# EAGLE design AccessControl (EAGLE 7.3.0)
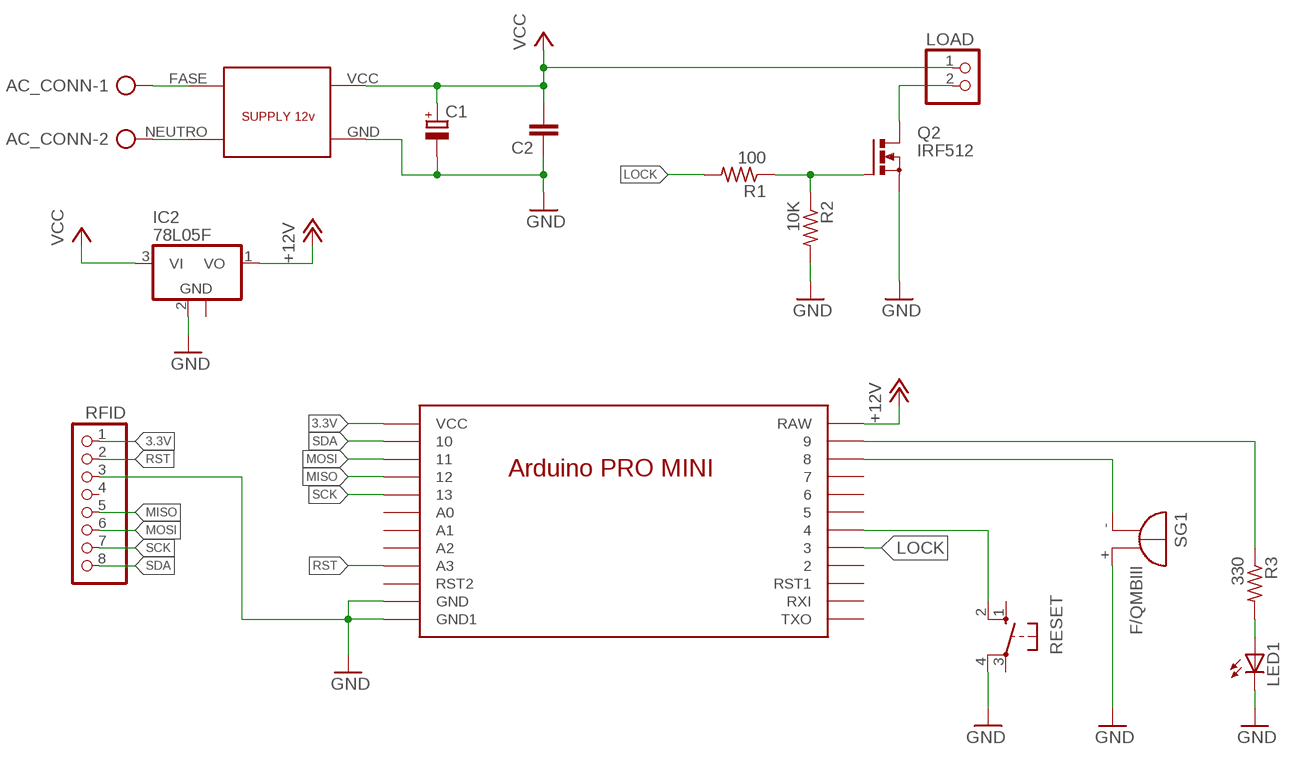
[diagram p0: schematic, sheet 1]

## Parts
AC_CONN  AK300/2  [AK300/2]
C1  CPOL-EUE2.5-6  [E2,5-6]
C2  C2.5/2  [C2.5-2]
IC2  78L05F  [SOT89]
LED1  LED3MM  [LED3MM]
LOAD  PINHD-1X2  [1X02]
Q2  IRF512  [TO220BV]
R1  100  R-US_0204/7  [0204/7]
R2  10K  R-US_0204/7  [0204/7]
R3  330  R-US_0204/7  [0204/7]
RESET  10-XX  [B3F-10XX]
RFID  PINHD-1X8  [1X08]
SG1  F/QMBIII  [F/QMBIII]
U$1  NANO  [NANO]
U$2  SUPPLY12V  [SUPPLY12V]

## Nets
3.3V: RFID.1 U$1.VCC
+12V: IC2.1(VO) U$1.RAW
GND: C1.- C2.1 IC2.2(GND) LED1.K(C) Q2.S R2.2 RESET.4(P1) RFID.3 SG1.+(-) U$1.GND1(GND) U$1.GND2(GND1) U$2.GND
LOCK: R1.2 U$1.3
MISO: RFID.5 U$1.12
MOSI: RFID.6 U$1.11
N$1: Q2.G R1.1 R2.1
N$2: AC_CONN.2 U$2.NEUTRO
N$3: LOAD.2 Q2.D
N$4: LED1.A R3.2
N$5: AC_CONN.1 U$2.FASE
N$6: SG1.-(+) U$1.8
N$7: RESET.2(S1) U$1.4
N$8: R3.1 U$1.9
RST: RFID.2 U$1.A3
SCK: RFID.7 U$1.13
SDA: RFID.8 U$1.10
VCC: C1.+ C2.2 IC2.3(VI) LOAD.1 U$2.VCC
Unconnected: IC2.2@1(GND) RESET.1(S) RESET.3(P) RFID.4 U$1.2 U$1.5 U$1.6 U$1.7 U$1.A0 U$1.A1 U$1.A2 U$1.RST1 U$1.RST2 U$1.RXI U$1.TXO

## Library data of the parts
AC_CONN = con-ptr500:AK300/2: CONNECTOR; OC_FARNELL: unknown; OC_NEWARK: unknown
C1 = resistor:CPOL-EU: POLARIZED CAPACITOR, European symbol
C2 = capacitor-wima:C: CAPACITOR naming: grid - package width
IC2 = linear:78L*: POSITOIV-VOLTAGE REGULATORS Output up to 100 mA Source: Datasheet <http://focus.ti.com/lit/ds/symlink/ua78l05.pdf>
LED1 = led:LED: LED OSRAM: - CHIPLED LG R971, LG N971, LY N971, LG Q971, LY Q971, LO R971, LY R971 LH N974, LH R974 LS Q976, LO Q976, LY Q976 LO Q996 - Hyper CHIPLED LW Q18S LB Q993, LB Q99A, LB R99A - SideLED LS A670, LO A670, LY A670, LG A670, LP A670 LB A673, LV A673, LT A673, LW A673 LH A674 LY A675 LS A676, LA A676, LO A676, LY A676, LW A676 LS A679, LY A679, LG A679 - Hyper Micro SIDELED® LS Y876, LA Y876, LO Y876, LY Y876 LT Y87S - SmartLED LW L88C, LW L88S LB L89C, LB L89S, LG L890 LS L89K, LO L89K, LY L89K LS L896, LA L896, LO L896, LY L896 - TOPLED LS T670, LO T670, LY T670, LG T670, LP T670 LSG T670, LSP T670, LSY T670, LOP T670, LYG T670 LG T671, LOG T671, LSG T671 LB T673, LV T673, LT T673, LW T673 LH T674 LS T676, LA T676, LO T676, LY T676, LB T676, LH T676, LSB T676, LW T676 LB T67C, LV T67C, LT T67C, LS T67K, LO T67K, LY T67K, LW E67C LS E67B, LA E67B, LO E67B, LY E67B, LB E67C, LV E67C, LT E67C LW T67C LS T679, LY T679, LG T679 LS T770, LO T770, LY T770, LG T770, LP T770 LB T773, LV T773, LT T773, LW T773 LH T774 LS E675, LA E675, LY E675, LS T675 LS T776, LA T776, LO T776, LY T776, LB T776 LHGB T686 LT T68C, LB T68C - Hyper Mini TOPLED® LB M676 - Mini TOPLED Santana® LG M470 LS M47K, LO M47K, LY M47K Source: http://www.osram.convergy.de LUXEON: - LUMILED® LXK2-PW12-R00, LXK2-PW12-S00, LXK2-PW14-U00, LXK2-PW14-V00 LXK2-PM12-R00, LXK2-PM12-S00, LXK2-PM14-U00 LXK2-PE12-Q00, LXK2-PE12-R00, LXK2-PE12-S00, LXK2-PE14-T00, LXK2-PE14-U00 LXK2-PB12-K00, LXK2-PB12-L00, LXK2-PB12-M00, LXK2-PB14-N00, LXK2-PB14-P00, LXK2-PB14-Q00 LXK2-PR12-L00, LXK2-PR12-M00, LXK2-PR14-Q00, LXK2-PR14-R00 LXK2-PD12-Q00, LXK2-PD12-R00, LXK2-PD12-S00 LXK2-PH12-R00, LXK2-PH12-S00 LXK2-PL12-P00, LXK2-PL12-Q00, LXK2-PL12-R00 Source: www.luxeon.com KINGBRIGHT: KA-3528ASYC Source: www.kingbright.com
LOAD = pinhead:PINHD-1X2: PIN HEADER
Q2 = transistor-power:IRF512: N-CHANNEL MOS FET
R1-R3 = resistor:R-US_: RESISTOR, American symbol
RESET = switch-omron:10-XX: OMRON SWITCH; MPN: B3F-1000; OC_FARNELL: 176432; OC_NEWARK: 36M3542
RFID = pinhead:PINHD-1X8: PIN HEADER
SG1 = buzzer:F/QMBIII: BUZZER Source: Buerklin; OC_FARNELL: unknown; OC_NEWARK: unknown
U$1 = E-Lab:NANO
U$2 = E-Lab:SUPPLY12V

## Board
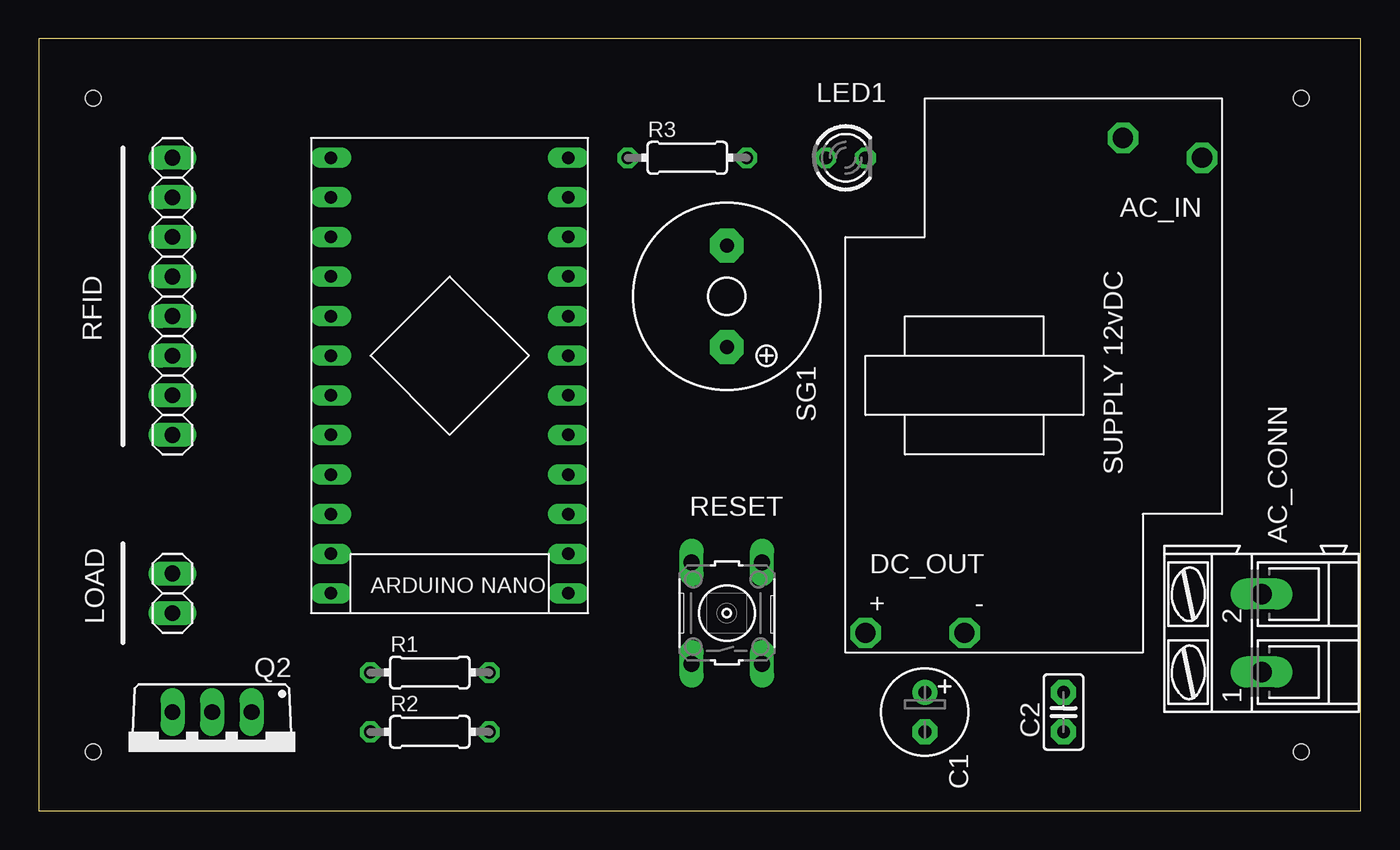
[diagram p1: board, top side]
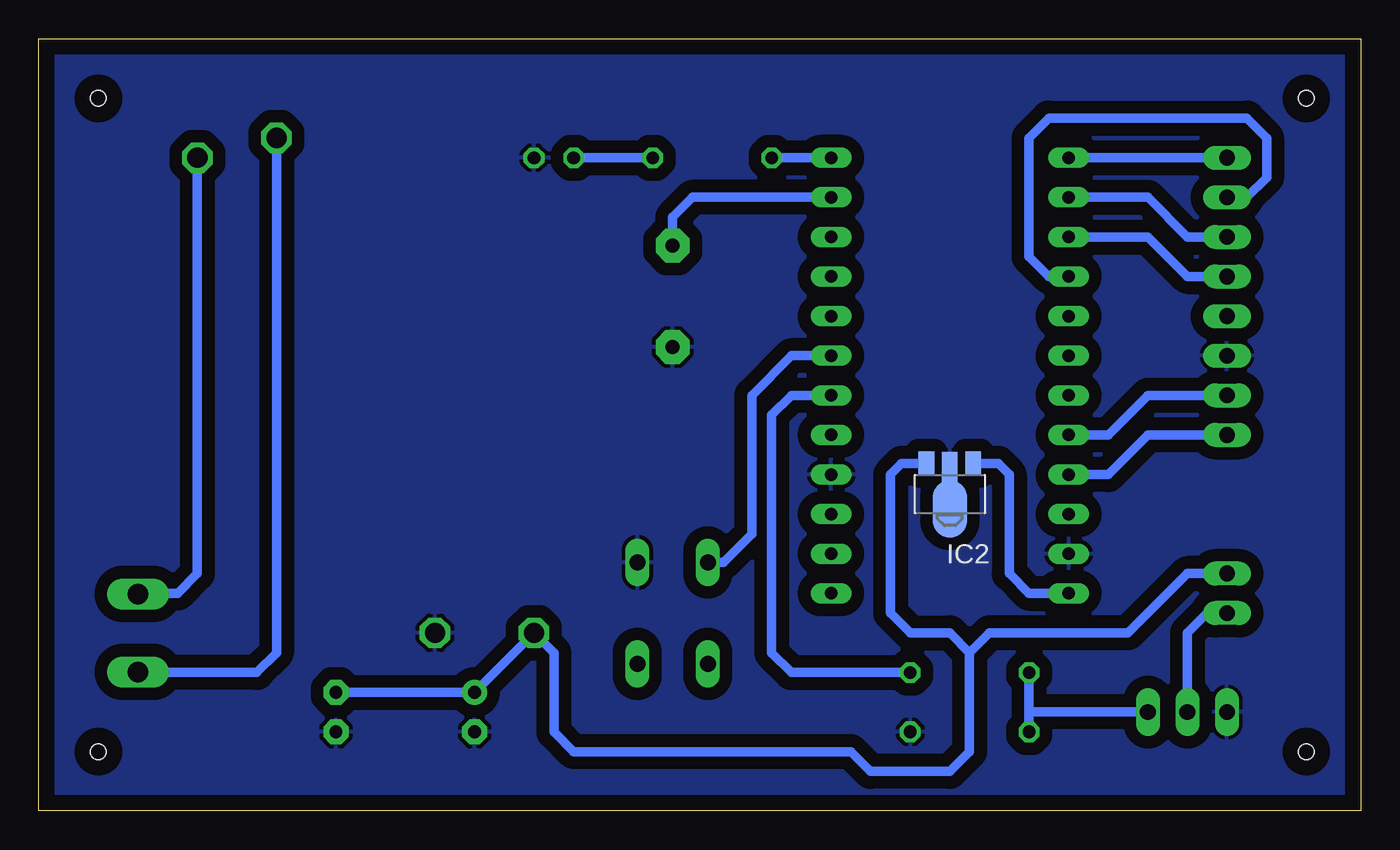
[diagram p2: board, bottom side, seen from below]

Size 84.76 x 49.52 mm. Coordinates in mm from the lower left corner, seen from the top.
Outline: 84.76,49.52 0,49.52 0,0 84.76,0 84.76,49.52
Copper layers (1*16): Top 0.035mm / dielectric 1.5mm / Bottom 0.035mm
Design rules "default": minimum track width 10mil, minimum drill 24mil, track to track 8mil, track to pad 8mil, pad to pad 8mil, via to via 8mil, smd to smd 8mil, copper to edge 40mil, drill to drill 8mil, minimum pad ring 10mil, minimum via ring 8mil, stop-mask expansion 4mil, vias tented up to drill 0mil, thermal gap 10mil
Holes 1 mm at 80.95,45.71 80.95,3.8 3.48,3.8 3.48,45.71

### Footprints (pad centres in the part's own frame; a part is rotated, then mirrored left to right if it is on the bottom)
AK300/2 = drill 1.321 long: 1 -2.515,0; 2 2.489,0
E2,5-6 = drill 0.813 pad 1.6: + -1.27,0 | drill 0.813 pad 1.6 octagon: - 1.27,0
C2.5-2 = drill 0.813 pad 1.6 octagon: 1 -1.27,0; 2 1.27,0
SOT89 = smd 1 x 1.5: 1 -1.499,-1.981; 3 1.499,-1.981 | smd 1 x 2: 2 0,-1.727 | smd 2.2 x 3.7: 2@1 0,0.94
LED3MM = drill 0.813 octagon: A -1.27,0; K 1.27,0
1X02 = drill 1.016 long: 1 -1.27,0; 2 1.27,0
TO220BV = drill 1.016 long: D 0,-2.54; G -2.54,-2.54; S 2.54,-2.54
0204/7 = drill 0.813 octagon: 1 -3.81,0; 2 3.81,0
B3F-10XX = drill 1.016 long: 1 -3.251,2.261; 2 3.251,2.261; 3 -3.251,-2.261; 4 3.251,-2.261
1X08 = drill 1.016 long: 1 -8.89,0; 2 -6.35,0; 3 -3.81,0; 4 -1.27,0; 5 1.27,0; 6 3.81,0; 7 6.35,0; 8 8.89,0
F/QMBIII = drill 0.914 pad 2.159 octagon: + 3.251,0; - -3.251,0
NANO = drill 0.8 long: 2 7.62,-5.08; 3 7.62,-2.54; 4 7.62,0; 5 7.62,2.54; 6 7.62,5.08; 7 7.62,7.62; 8 7.62,10.16; 9 7.62,12.7; 10 -7.62,12.7; 11 -7.62,10.16; 12 -7.62,7.62; 13 -7.62,5.08; A0 -7.62,2.54; A1 -7.62,0; A2 -7.62,-2.54; A3 -7.62,-5.08; GND1 -7.62,-12.7; GND2 7.62,-7.62; RAW -7.62,-15.24; RST1 -7.62,-10.16; RST2 7.62,-10.16; RXI 7.62,-12.7; TXO 7.62,-15.24; VCC -7.62,-7.62
SUPPLY12V = drill 1.3 octagon: FASE 15.24,-5.08; GND -16.51,5.08; NEUTRO 13.97,-10.16; VCC -16.51,11.43

### Placement (x,y rotation side)
AC_CONN  78.41,11.42 90 top
C1  56.82,6.34 270 top
C2  65.71,6.34 90 top
IC2  26.34,20.31 180 bottom
LED1  51.74,41.9 0 top
LOAD  8.56,13.96 270 top
Q2  11.1,3.8 180 top
R1  25.07,8.88 0 top
R2  25.07,5.07 0 top
R3  41.58,41.9 0 top
RESET  44.12,12.69 90 top
RFID  8.56,33.01 90 top
SG1  44.12,33.01 270 top
U$1  26.34,29.2 0 top
U$2  64.44,27.93 90 top

### Tracks (layer width: path | path; a pad name or v marks a point on that pad's centre or on a via)
3.3V
  Bottom 0.61: RFID.1 13.64,24.12 16.18,21.58 U$1.VCC
+12V
  Bottom 0.61: IC2.1 23.24,22.29 22.53,21.58 22.53,15.23 21.26,13.96 U$1.RAW
GND
  pour Bottom (isolate 0.813): 84.76,49.52 84.76,-0.01 -0.33,-0.01 -0.33,49.52
LOCK
  Bottom 0.61: U$1.3 36.5,26.66 37.77,25.39 37.77,10.15 36.5,8.88 R1.2
MISO
  Bottom 0.61: U$1.12 13.64,36.82 11.1,34.28 RFID.5
MOSI
  Bottom 0.61: U$1.11 13.64,39.36 11.1,36.82 RFID.6
N$1
  Bottom 0.61: R1.1 21.26,6.34 | 21.26,6.34 R2.1 | Q2.G 21.26,6.34
N$2
  Bottom 0.61: U$2.NEUTRO 74.6,15.23 75.87,13.96 78.36,13.96 AC_CONN.2
N$3
  Bottom 0.61: LOAD.2 9.83,12.69 11.1,11.42 Q2.D
N$4
  Bottom 0.61: LED1.A R3.2
N$5
  Bottom 0.61: U$2.FASE 69.52,10.15 70.79,8.88 78.38,8.88 AC_CONN.1
N$6
  Bottom 0.61: U$1.8 42.85,39.36 44.12,38.09 SG1.-
N$7
  Bottom 0.61: U$1.4 36.5,29.2 39.04,26.66 39.04,17.77 40.87,15.94 RESET.2
N$8
  Bottom 0.61: R3.1 U$1.9
RST
  Bottom 0.61: RFID.2 13.64,26.66 16.18,24.12 U$1.A3
SCK
  Bottom 0.61: U$1.13 19.99,34.28 21.26,35.55 21.26,43.17 19.99,44.44 7.29,44.44 6.02,43.17 6.02,40.63 7.29,39.36 RFID.7
SDA
  Bottom 0.61: U$1.10 RFID.8
VCC
  Bottom 0.61: LOAD.1 11.1,15.23 14.91,11.42 23.8,11.42 25.07,10.15 | 25.07,10.15 25.07,3.8 26.34,2.53 31.42,2.53 32.69,3.8 50.47,3.8 51.74,5.07 51.74,10.15 U$2.VCC C1.+ C2.2 | IC2.3 29.44,22.29 30.15,21.58 30.15,12.69 28.88,11.42 26.34,11.42 25.07,10.15